# EAGLE design etl1 (EAGLE 6.2)
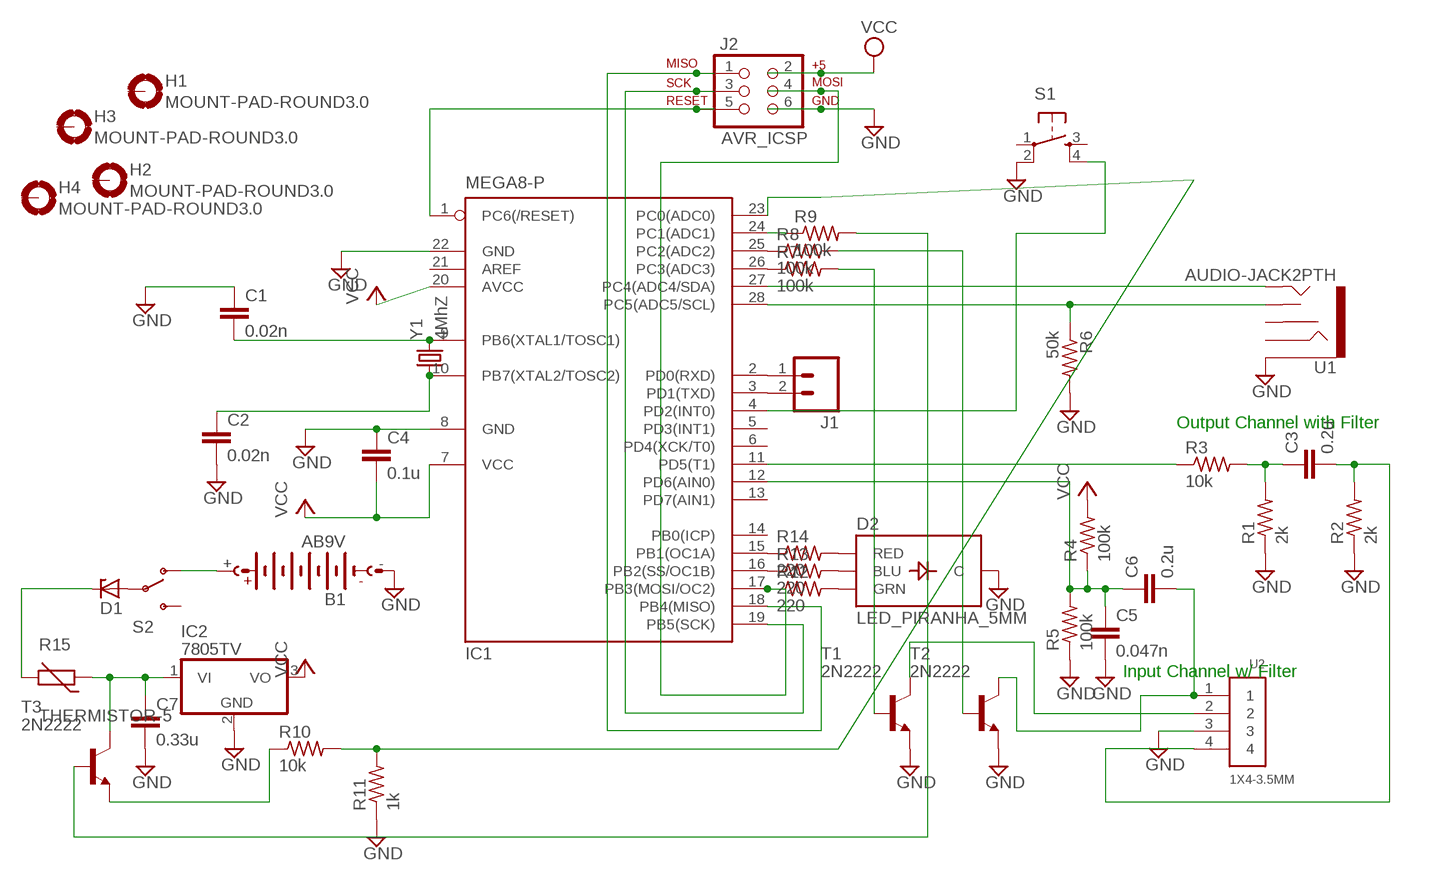
[diagram p0: schematic, sheet 1]

## Parts
B1  AB9V  [AB9V]
C1  0.02n  C5/3  [C5B3]
C2  0.02n  C5/3  [C5B3]
C3  0.2u  C5/3  [C5B3]
C4  0.1u  C5/3  [C5B3]
C5  0.047n  C5/3  [C5B3]
C6  0.2u  C5/3  [C5B3]
C7  0.33u  C5/3  [C5B3]
D1  ZENER-DIODEZD-10  [ZDIO-10]
D2  LED_PIRANHA_5MM  [LED_PIRANHA_5MM]
H1  MOUNT-PAD-ROUND3.0  [3,0-PAD]
H2  MOUNT-PAD-ROUND3.0  [3,0-PAD]
H3  MOUNT-PAD-ROUND3.0  [3,0-PAD]
H4  MOUNT-PAD-ROUND3.0  [3,0-PAD]
IC1  MEGA8-P  [DIL28-3]
IC2  7805TV  [TO220V]
J1  M02LOCK  [1X02_LOCK]
J2  AVR_ICSP  AVR_SPI_PRG_6NS  [2X3-NS]
R1  2k  R-US_0207/10  [0207/10]
R2  2k  R-US_0207/10  [0207/10]
R3  10k  R-US_0207/10  [0207/10]
R4  100k  R-US_0207/10  [0207/10]
R5  100k  R-US_0207/10  [0207/10]
R6  50k  R-US_0207/10  [0207/10]
R7  100k  R-US_0207/10  [0207/10]
R8  100k  R-US_0207/10  [0207/10]
R9  100k  R-US_0207/10  [0207/10]
R10  10k  R-US_0207/10  [0207/10]
R11  1k  R-US_0207/10  [0207/10]
R12  220  R-US_0207/10  [0207/10]
R13  220  R-US_0207/10  [0207/10]
R14  220  R-US_0207/10  [0207/10]
R15  THERMISTOR-5  [R-5]
S1  TAC_SWITCHPTH  [TACTILE-PTH]
S2  SWITCH-SPDTPTH  [SWITCH-SPDT]
T1  2N2222  [TO92-EBC-OVAL]
T2  2N2222  [TO92-EBC-OVAL]
T3  2N2222  [TO92-EBC-OVAL]
U1  AUDIO-JACK2PTH  [AUDIO-JACK]
U2  1X4-3.5MM  [1X04-3.5MM]
Y1  4MhZ  CRYSTALHC49US  [HC49US]

## Nets
GND: B1.- C1.1 C2.2 C4.1 C5.2 C7.2 D2.-(C) IC1.8(GND) IC1.22(GND) IC2.2(GND) J2.6 R1.1 R2.1 R5.1 R6.2 R11.1 S1.2 T1.E T2.E U1.SLEEVE U2.3
N$1: C1.2 IC1.9(PB6(XTAL1/TOSC1)) Y1.2
N$2: C2.1 IC1.10(PB7(XTAL2/TOSC2)) Y1.1
N$3: IC1.16(PB2(SS/OC1B)) R13.1
N$4: IC1.15(PB1(OC1A)) R14.1
N$5: IC1.17(PB3(MOSI/OC2)) J2.4 R12.1
N$6: D2.G(GRN) R12.2
N$7: D2.B(BLU) R13.2
N$8: D2.R(RED) R14.2
N$9: IC1.11(PD5(T1)) R3.1
N$10: C5.1 C6.1 IC1.12(PD6(AIN0)) R4.1 R5.2
N$11: C3.1 R1.2 R3.2
N$12: C3.2 R2.2 U2.4
N$13: D1.A S2.2(P)
N$14: D1.C R15.2
N$15: C7.1 IC2.1(VI) R15.1 T3.C
N$16: IC1.24(PC1(ADC1)) R9.1
N$17: IC1.26(PC3(ADC3)) R7.1
N$18: IC1.25(PC2(ADC2)) R8.1
N$19: IC1.27(PC4(ADC4/SDA)) U1.TIP
N$20: IC1.28(PC5(ADC5/SCL)) R6.1 U1.TSH
N$21: R10.1 T3.E
N$22: IC1.23(PC0(ADC0)) R10.2 R11.2
N$23: R9.2 T3.B
N$24: R7.2 T1.B
N$25: R8.2 T2.B
N$26: IC1.4(PD2(INT0)) S1.4
N$27: B1.+ S2.1(O)
N$28: T1.C U2.2
N$29: C6.2 T2.C U2.1
N$30: IC1.18(PB4(MISO)) J2.1
N$31: IC1.19(PB5(SCK)) J2.3
N$32: IC1.1(PC6(/RESET)) J2.5
N$33: IC1.2(PD0(RXD)) J1.1
N$34: IC1.3(PD1(TXD)) J1.2
VCC: C4.2 IC1.7(VCC) IC1.20(AVCC) IC2.3(VO) J2.2 R4.2
Unconnected: H1.B3,0(MOUNT) H2.B3,0(MOUNT) H3.B3,0(MOUNT) H4.B3,0(MOUNT) IC1.5(PD3(INT1)) IC1.6(PD4(XCK/T0)) IC1.13(PD7(AIN1)) IC1.14(PB0(ICP)) IC1.21(AREF) S1.1 S1.3 S2.3(S) U1.RING U1.RSH

## Notes on the sheet
- Output Channel with Filter
- Input Channel w/ Filter

## Library data of the parts
B1 = battery:AB9V: 9-V BATTERY CLIP
C1-C7 = capacitor-wima:C: CAPACITOR naming: grid - package width
D1 = diode:ZENER-DIODE: Z-Diode
D2 = SparkFun-LED:LED_PIRANHA_5MM: High-brightness RGB through-hole LED, similar to that used in the Shiftbrite
H1-H4 = holes:MOUNT-PAD-ROUND: MOUNTING PAD, round
IC1 = atmel:MEGA8-P: MICROCONTROLLER 8 Kbytes FLASH, 1 kbytes SRAM, 512 bytes EEPROM, USART, 4-channel 10 bit ADC, 2-channel 8 bit ADC Pin compatible with Atmega48, ATMega88, ATMega168 Source: avr.lbr; OC_FARNELL: unknown; OC_NEWARK: unknown
IC2 = linear:78*: Positive VOLTAGE REGULATOR Source: http://cache.national.com/ds/LM/LM78L05.pdf http://www.fairchildsemi.com/ds/LM/LM7805.pdf
J1 = SparkFun-Connectors:M02: Header 2 Standard 2-pin 0.1" header. Use with straight break away headers (SKU : PRT-00116), right angle break away headers (PRT-00553), swiss pins (PRT-00743), machine pins (PRT-00117), and female headers (PRT-00115). Molex polarized connector foot print use with SKU : PRT-08233 with associated crimp pins and housings.
J2 = SparkFun-Connectors:AVR_SPI_PRG_6: AVR ISP 6 Pin This is the reduced ISP connector for AVR programming. Common on Arduino. This footprint will take up less PCB space and can be used with a 10-pin to 6-pin adapter such as SKU: BOB-08508
R1-R14 = rcl:R-US_: RESISTOR, American symbol
R15 = varistor:THERMISTOR: THERMISTOR
S1 = SparkFun-Electromechanical:TAC_SWITCH: Momentary Switch Button commonly used for reset or general input. Spark Fun Electronics SKU : COM-00097
S2 = SparkFun-Electromechanical:SWITCH-SPDT: SPST Switch Simple slide switch. Spark Fun Electronics SKU : COM-00102
T1-T3 = adafruit:2N2222: NPN TRANSISTOR Big oval pads
U1 = SparkFun-Connectors:AUDIO-JACK2: Stereo audio jack with bypass switches.
U2 = adafruit:1X4: 4-pin connector
Y1 = SparkFun-FreqCtrl:CRYSTAL: Various standard crystals. Proven footprints. Spark Fun Electronics SKU : COM-00534

## Board
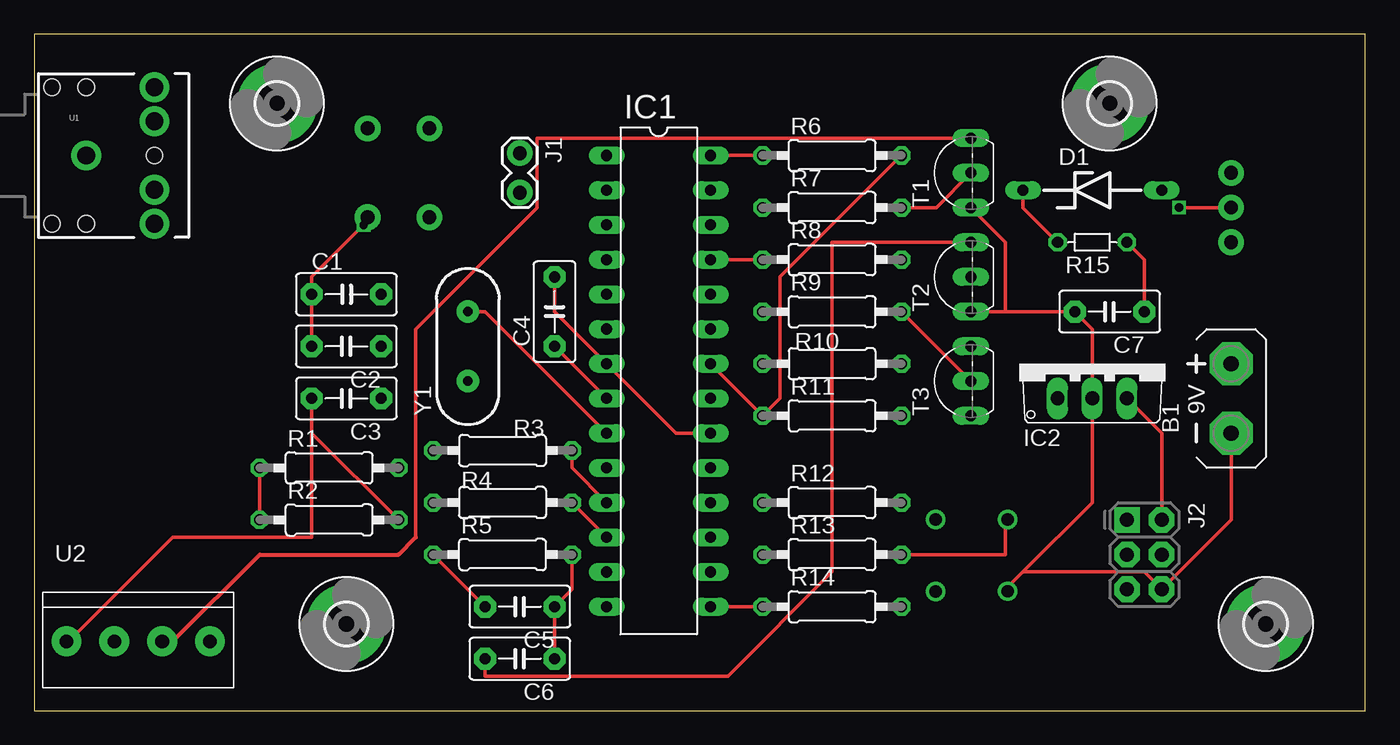
[diagram p1: board, top side]
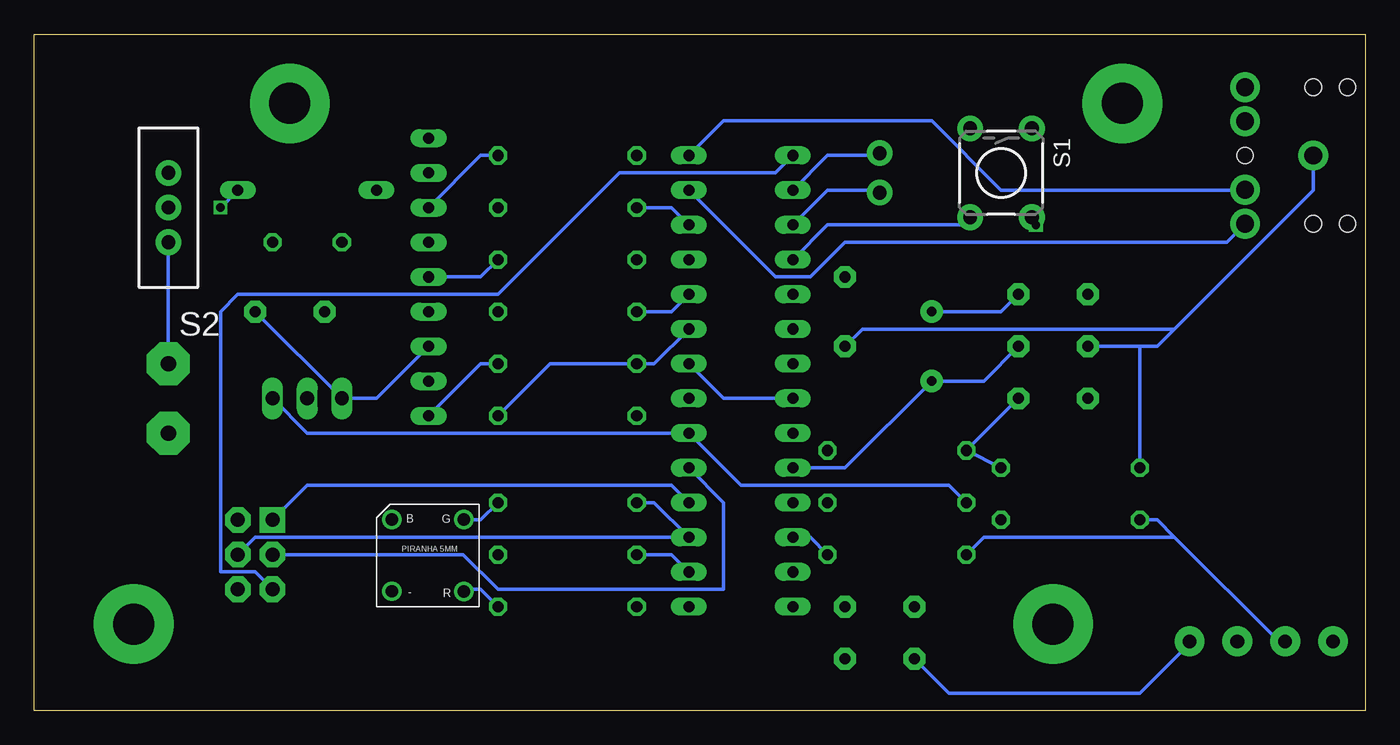
[diagram p2: board, bottom side, seen from below]

Size 97.46 x 49.52 mm. Coordinates in mm from the lower left corner, seen from the top.
Outline: 0,0 97.46,0 97.46,49.52 0,49.52 0,0
Copper layers (1*16): Top 0.035mm / dielectric 1.5mm / Bottom 0.035mm
Design rules: minimum track width 10mil, minimum drill 24mil, track to track 8mil, track to pad 8mil, pad to pad 8mil, via to via 8mil, smd to smd 8mil, copper to edge 20mil, drill to drill 8mil, minimum pad ring 10mil, minimum via ring 8mil, stop-mask expansion 4mil, vias tented up to drill 0mil, thermal gap 10mil

### Footprints (pad centres in the part's own frame; a part is rotated, then mirrored left to right if it is on the bottom)
AB9V = drill 1.118 pad 3.15 octagon: + 0,2.54; - 0,-2.54
C5B3 = drill 0.813 pad 1.6 octagon: 1 -2.54,0; 2 2.54,0
ZDIO-10 = drill 0.813 long: A 5.08,0; C -5.08,0
LED_PIRANHA_5MM = drill 0.9: - -2.684,-2.684; B -2.688,2.574; G 2.575,2.562; R 2.579,-2.696
3,0-PAD = drill 3 pad 5.842: B3,0 0,0
DIL28-3 = drill 0.813 long: 1 -16.51,-3.81; 2 -13.97,-3.81; 3 -11.43,-3.81; 4 -8.89,-3.81; 5 -6.35,-3.81; 6 -3.81,-3.81; 7 -1.27,-3.81; 8 1.27,-3.81; 9 3.81,-3.81; 10 6.35,-3.81; 11 8.89,-3.81; 12 11.43,-3.81; 13 13.97,-3.81; 14 16.51,-3.81; 15 16.51,3.81; 16 13.97,3.81; 17 11.43,3.81; 18 8.89,3.81; 19 6.35,3.81; 20 3.81,3.81; 21 1.27,3.81; 22 -1.27,3.81; 23 -3.81,3.81; 24 -6.35,3.81; 25 -8.89,3.81; 26 -11.43,3.81; 27 -13.97,3.81; 28 -16.51,3.81
TO220V = drill 1.016 long: 1 -2.54,-2.54; 2 0,-2.54; 3 2.54,-2.54
1X02_LOCK = drill 1.016 pad 1.88: 1 -0.178,0; 2 2.718,0
2X3-NS = drill 1.016 pad 1.88 square: 1 -2.54,-1.27 | drill 1.016 pad 1.88 octagon: 2 -2.54,1.27; 3 0,-1.27; 4 0,1.27; 5 2.54,-1.27; 6 2.54,1.27
0207/10 = drill 0.813 octagon: 1 -5.08,0; 2 5.08,0
R-5 = drill 0.813 octagon: 1 -2.54,0; 2 2.54,0
TACTILE-PTH = drill 1.016 pad 1.88: 1 -3.251,2.261; 2 3.251,2.261; 3 -3.251,-2.261; 4 3.251,-2.261
SWITCH-SPDT = drill 1.016 pad 1.88: 1 0,2.54; 2 0,0; 3 0,-2.54
TO92-EBC-OVAL = drill 0.813 long: B 0,-1.27; C 2.54,-1.27; E -2.54,-1.27
AUDIO-JACK = drill 1.3 pad 2.184: RING 5,5; RSH 5,2.5; SLEEVE 0,0; TIP 5,-5; TSH 5,-2.5 | hole 1.2: 0,5; -2.5,5; -2.5,-5; 0,-5; 5,0
1X04-3.5MM = drill 1 pad 2.184: 1 -5.25,0; 2 -1.75,0; 3 1.75,0; 4 5.25,0
HC49US = drill 0.7 pad 1.651: 1 -2.54,0; 2 2.54,0

### Placement (x,y rotation side)
B1  87.63,22.86 0 top
C1  22.86,30.48 0 top
C2  22.86,26.67 180 top
C3  22.86,22.86 180 top
C4  38.1,29.21 90 top
C5  35.56,7.62 180 top
C6  35.56,3.81 180 top
C7  78.74,29.21 180 top
D1  77.47,38.1 0 top
D2  68.58,11.43 0 bottom
H1  17.78,44.45 0 top
H2  90.17,6.35 0 top
H3  78.74,44.45 0 top
H4  22.86,6.35 0 top
IC1  45.72,24.13 270 top
IC2  77.47,25.4 0 top
J1  35.56,40.64 270 top
J2  81.28,11.43 270 top
R1  21.59,17.78 0 top
R2  21.59,13.97 0 top
R3  34.29,19.05 180 top
R4  34.29,15.24 180 top
R5  34.29,11.43 0 top
R6  58.42,40.64 0 top
R7  58.42,36.83 0 top
R8  58.42,33.02 0 top
R9  58.42,29.21 0 top
R10  58.42,25.4 180 top
R11  58.42,21.59 0 top
R12  58.42,15.24 0 top
R13  58.42,11.43 0 top
R14  58.42,7.62 0 top
R15  77.47,34.29 180 top
S1  26.67,39.37 270 bottom
S2  87.63,36.83 180 bottom
T1  67.31,39.37 90 top
T2  67.31,31.75 90 top
T3  67.31,24.13 90 top
U1  3.81,40.64 0 top
U2  7.62,5.08 180 top
Y1  31.75,26.67 90 top

### Tracks (layer width: path | path; a pad name or v marks a point on that pad's centre or on a via)
GND  (via drill 0.6)
  Top 0.254: B1.- 87.63,13.97 J2.6 81.28,10.16 72.39,10.16 | 71.12,29.21 C7.2 77.47,27.94 IC2.2 77.47,15.24 72.39,10.16 | 71.12,29.21 T2.E | 72.39,10.16 71.12,8.89 D2.- | T1.E 71.12,34.29 71.12,29.21 | IC1.22 R11.1 54.61,22.86 54.61,31.75 R6.2 | C4.1 IC1.8 | C5.2 R5.1 | R1.1 R2.1 | C2.2 C1.1 20.32,31.75 v24.13,35.56 S1.2
  Bottom 0.254: T1.E 64.77,40.64 R6.2 | IC1.22 46.99,22.86 IC1.8 | 16.51,26.67 R1.1 | C2.2 16.51,26.67 | U1.SLEEVE 3.81,38.1 13.97,27.94 | 13.97,27.94 15.24,26.67 16.51,26.67 | 13.97,12.7 15.24,13.97 R2.1 | 13.97,12.7 6.35,5.08 U2.3 | R5.1 27.94,12.7 13.97,12.7 | C4.1 36.83,27.94 13.97,27.94
N$1
  Top 0.254: IC1.9 33.02,29.21 Y1.2
  Bottom 0.254: C1.2 26.67,29.21 Y1.2
N$2
  Bottom 0.254: IC1.10 38.1,17.78 Y1.1 27.94,24.13 C2.1
N$3
  Bottom 0.254: IC1.16 50.8,11.43 R13.1
N$4
  Top 0.254: R14.1 IC1.15
N$5
  Bottom 0.254: R12.1 52.07,15.24 IC1.17 81.28,12.7 J2.4
N$6
  Bottom 0.254: R12.2 64.77,13.97 66.04,13.97 D2.G
N$7
  Top 0.254: R13.2 71.12,11.43 71.12,13.97 D2.B
N$8
  Bottom 0.254: R14.2 64.77,8.89 66.04,8.89 D2.R
N$9
  Top 0.254: R3.1 39.37,17.78 IC1.11
N$10
  Top 0.254: C6.1 C5.1 39.37,8.89 R5.2 | IC1.12 R4.1
  Bottom 0.254: R5.2 40.64,12.7 IC1.12
N$11
  Bottom 0.254: R1.2 R3.2 C3.1
N$12
  Top 0.254: 20.32,20.32 R2.2 | C3.2 20.32,20.32 | 20.32,20.32 20.32,12.7 10.16,12.7 2.54,5.08 U2.4
N$13  (via drill 0.6)
  Top 0.254: S2.2 v83.82,36.83
  Bottom 0.254: v83.82,36.83 D1.A
N$14
  Top 0.254: R15.2 72.39,36.83 D1.C
N$15
  Top 0.254: R15.1 81.28,33.02 C7.1
  Bottom 0.254: T3.C 72.39,22.86 IC2.1 C7.1
N$16
  Bottom 0.254: IC1.24 50.8,29.21 R9.1
N$17
  Bottom 0.254: IC1.26 50.8,36.83 R7.1
N$18
  Top 0.254: R8.1 IC1.25
N$19
  Bottom 0.254: IC1.27 43.18,31.75 40.64,31.75 38.1,34.29 10.16,34.29 U1.TIP
N$20
  Top 0.254: R6.1 IC1.28
  Bottom 0.254: IC1.28 46.99,43.18 31.75,43.18 26.67,38.1 8.89,38.1 U1.TSH
N$21
  Bottom 0.254: T3.E 64.77,25.4 R10.1
N$22
  Bottom 0.254: IC1.23 52.07,25.4 R10.2 59.69,25.4 R11.2
N$23
  Top 0.254: R9.2 T3.B
N$24
  Top 0.254: R7.2 66.04,36.83 T1.B
N$25
  Bottom 0.254: R8.2 64.77,31.75 T2.B
N$26
  Bottom 0.254: IC1.4 39.37,35.56 29.21,35.56 S1.4
N$27
  Bottom 0.254: B1.+ S2.1
N$28
  Top 0.254: T1.C 36.83,41.91 36.83,36.83 27.94,27.94 27.94,12.7
  Top 0.305: U2.2 10.16,5.08 16.51,11.43 26.67,11.43 27.94,12.7
N$29
  Top 0.254: T2.C 58.42,34.29 58.42,10.16 50.8,2.54 33.02,2.54 C6.2
  Bottom 0.254: C6.2 30.48,1.27 16.51,1.27 12.7,5.08 U2.1
N$30
  Bottom 0.254: IC1.18 50.8,16.51 77.47,16.51 J2.1
N$31
  Bottom 0.254: IC1.19 46.99,15.24 46.99,8.89 63.5,8.89 66.04,11.43 J2.3
N$32
  Bottom 0.254: IC1.1 43.18,39.37 54.61,39.37 63.5,30.48 82.55,30.48 83.82,29.21 83.82,10.16 81.28,10.16 J2.5
N$33
  Bottom 0.254: IC1.2 39.37,40.64 35.56,40.64 J1.1
N$34
  Bottom 0.254: IC1.3 39.37,38.1 35.56,38.1 J1.2
VCC
  Top 0.254: IC2.3 82.55,20.32 J2.2 | C4.2 38.1,29.21 IC1.7 46.99,20.32 IC1.20
  Bottom 0.254: R4.2 30.48,16.51 45.72,16.51 IC1.20 77.47,20.32 IC2.3